# EasyEDA schematic RC_Controller.json
TITLE: Sheet_1; REV: 1.0; Date: 2023-11-12; Sheet: 1/1; Company: Your Company
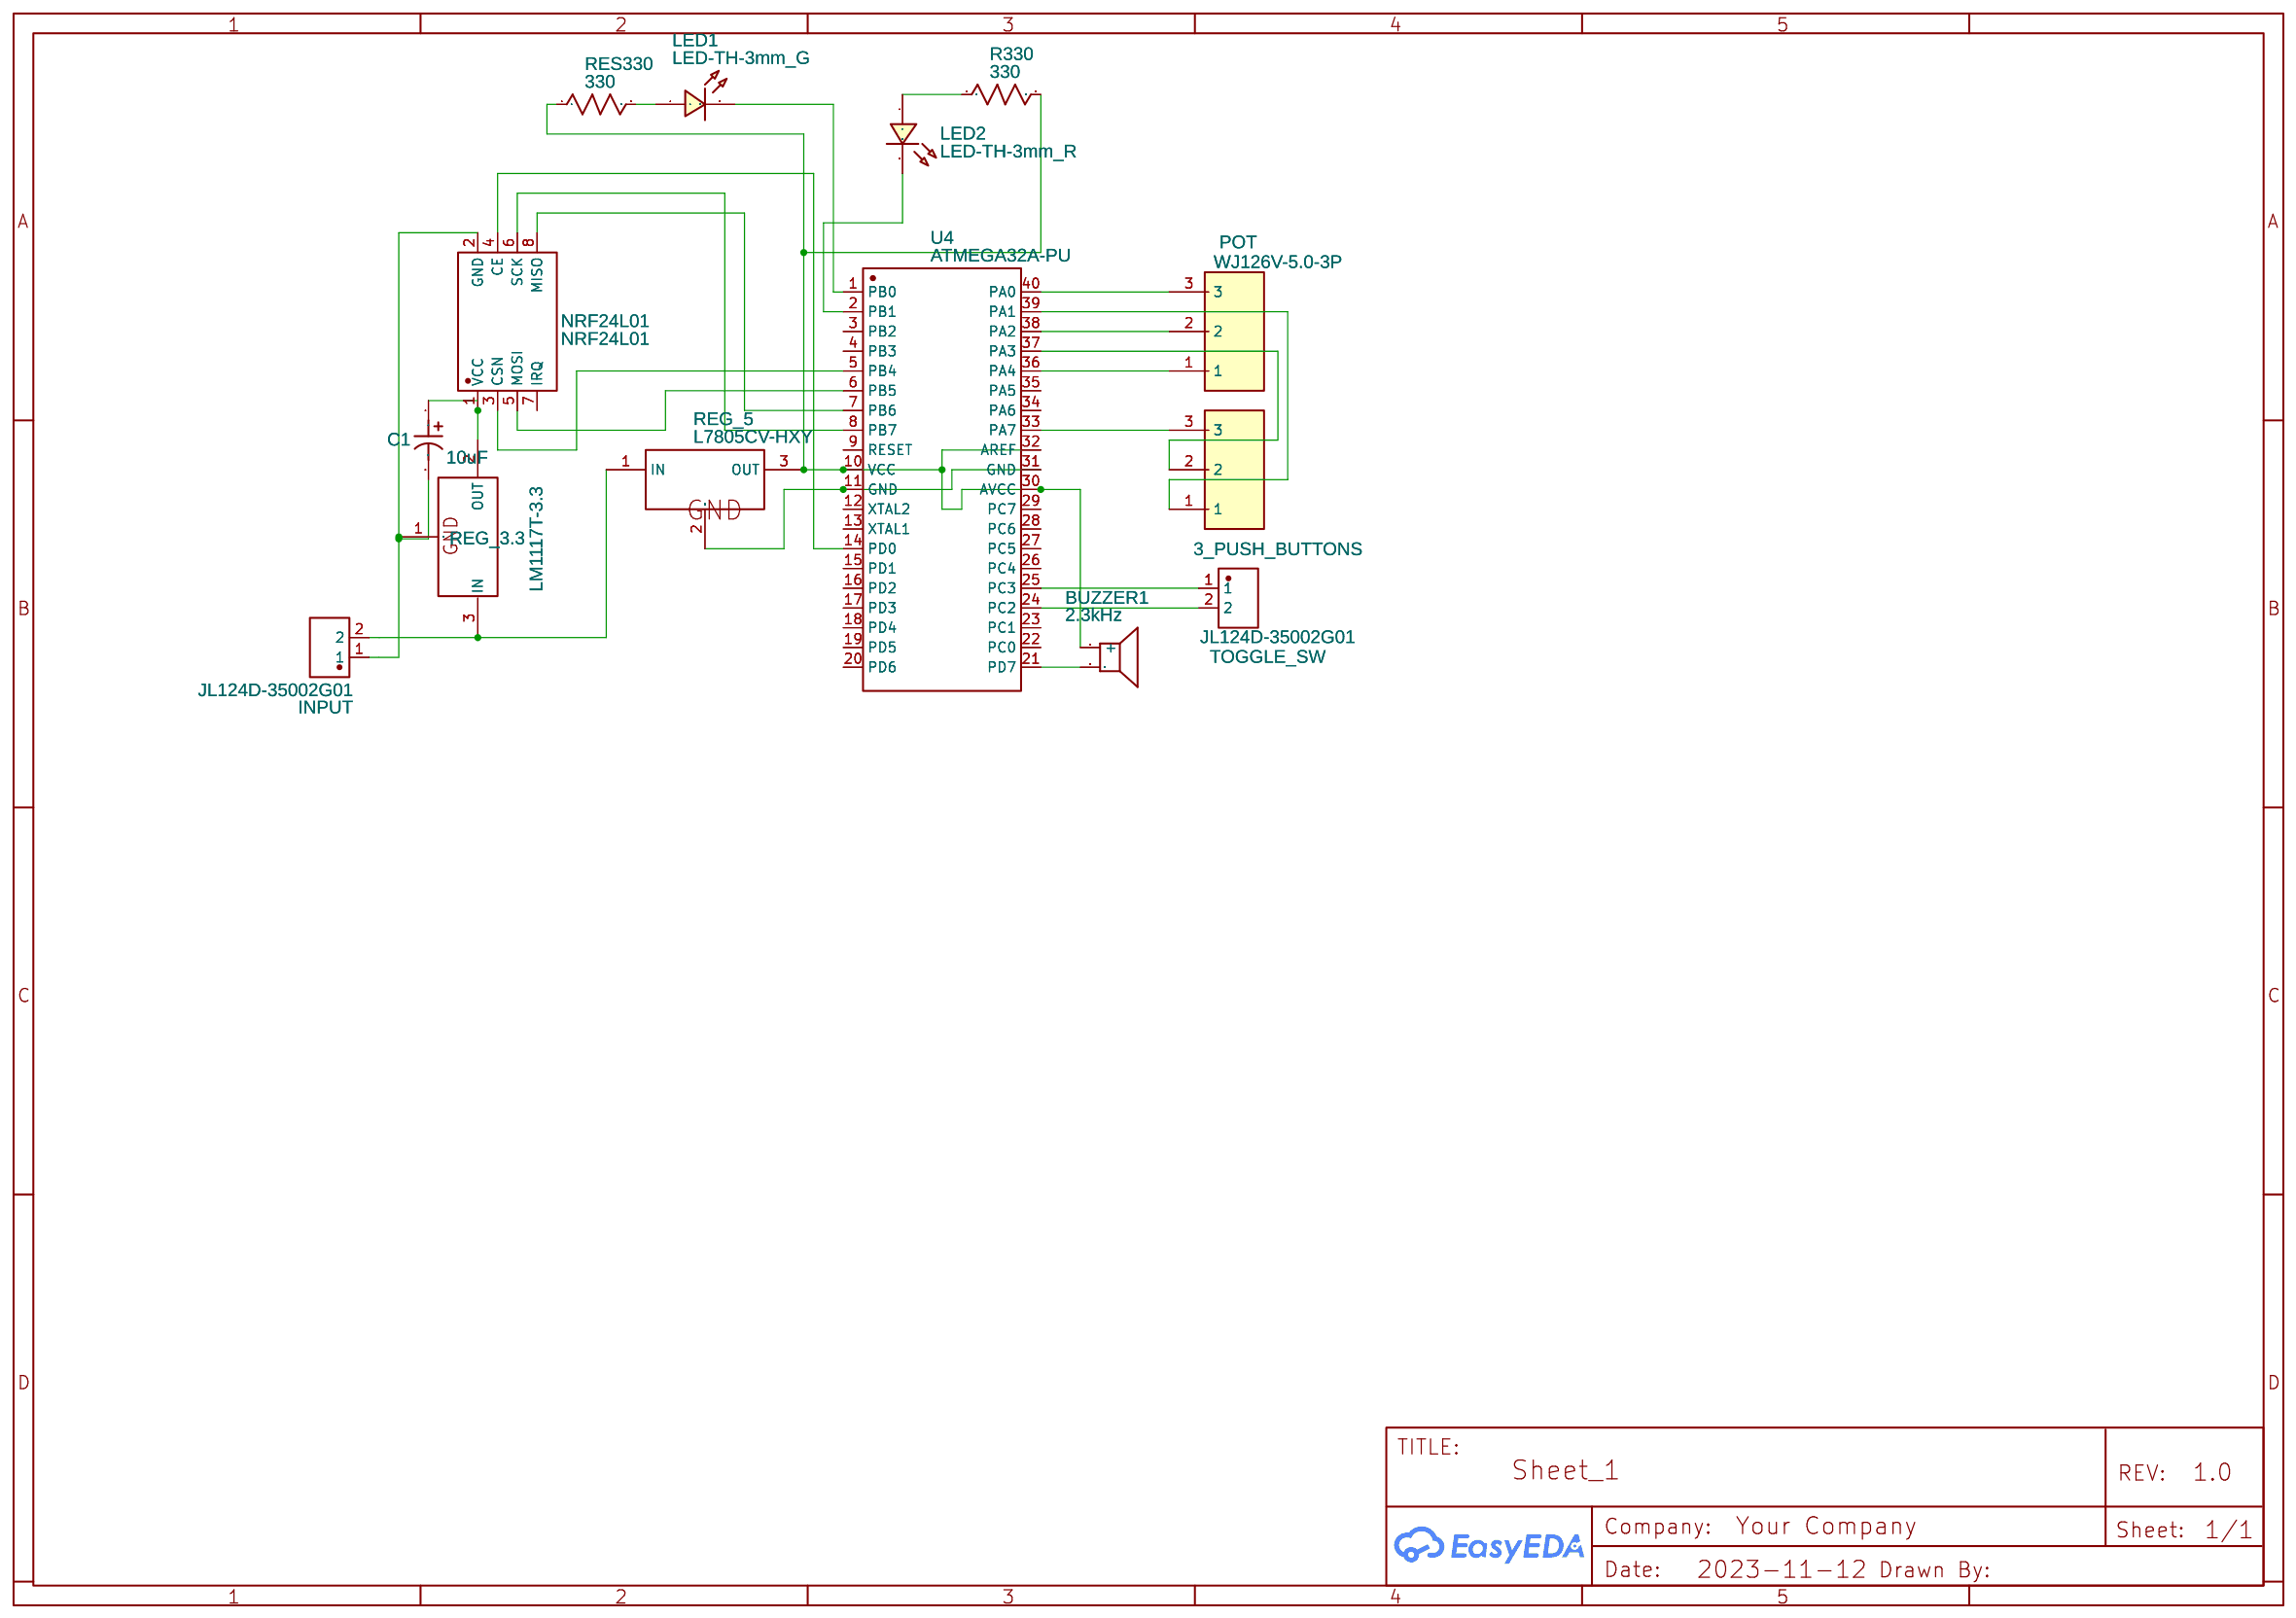
[diagram p0: schematic sheet]

## Parts
3_PUSH_BUTTONS  3_PUSH_BUTTONS  [CONN-TH_3P-P5.00_WJ126V-5.0-3P]
BUZZER1  2.3kHz  [BUZ-TH_BD12.0-P7.60-D0.6-FD]
C1  10uF  [CAP-TH_BD5.0-P2.00-D0.5-FD-1]
INPUT  JL124D-35002G01  [CONN-TH_2P-P3.50_JL124D-35002G01]
LED1  LED-TH-3mm_G  [LED-TH_BD3.0_GREEN]
LED2  LED-TH-3mm_R  [LED-TH_BD3.0_RED]
NRF24L01  NRF24L01  [WIRELM-SMD_NRF24L01]
POT  WJ126V-5.0-3P  [CONN-TH_3P-P5.00_WJ126V-5.0-3P]
R330  330  [R_AXIAL-0.3]
REG_3  LM1117T-3.3  [TO-220-3_L10.0-W4.5-P2.54-L]  (section 3)
REG_5  L7805CV-HXY  [TO-220-3_L10.0-W4.5-P2.54-L]
RES330  330  [R_AXIAL-0.3]
TOGGLE_SW  JL124D-35002G01  [CONN-TH_2P-P3.50_JL124D-35002G01]
U4  ATMEGA32A-PU  [DIP-40_L52.3-W13.9-P2.54-LS15.2-BL]

## Library data of the parts
3_PUSH_BUTTONS POT = WJ126V-5.0-3P: Supplier: LCSC; Manufacturer: KANGNEX(康奈克斯电气); Supplier Part: C8401; JLCPCB Part Class: Extended Part; link: https://lcsc.com/eda_search?q=C8401&%26type=1&ref=editor
BUZZER1 = TMB12A05: Supplier: LCSC; Manufacturer: 华能; Supplier Part: C96093; JLCPCB Part Class: Extended Part; link: https://lcsc.com/eda_search?q=C96093&%26type=1&ref=editor
C1 = EGH1HM100D11OT: Contributor: lcsc; Supplier: LCSC; Supplier Part: C724632; Manufacturer: AISHI(艾华集团); JLCPCB Part Class: Extended Part; link: https://lcsc.com/eda_search?q=C724632&%26type=1&ref=editor
INPUT TOGGLE_SW = JL124D-35002G01: Contributor: LCSC; Supplier: LCSC; Supplier Part: C415432; Manufacturer: JILN(锦凌); JLCPCB Part Class: Extended Part; link: https://lcsc.com/eda_search?q=C415432&%26type=1&ref=editor
LED1 = LED-TH-3mm_G: Manufacturer: EVERLIGHT(台湾亿光); Manufacturer Part: 204-10SYGD/S530-E3; Supplier Part: C85161; Contributor: LCEDA_Lib
LED2 = LED-TH-3mm_R: Manufacturer: EVERLIGHT(台湾亿光); Manufacturer Part: 204-10SDRD/S530-A3-L; Supplier Part: C84774; Supplier: LCSC; Contributor: LCEDA_Lib
NRF24L01 = NRF24L01: Supplier: LCSC; Manufacturer: Ai-Thinker(安信可); Manufacturer Part: NF-04; Supplier Part: C90751; JLCPCB Part Class: Extended Part; link: https://lcsc.com/eda_search?q=C90751&%26type=1&ref=editor
R330 RES330 = R_AXIAL-0.3_US: Contributor: LCEDA_Lib
REG_3 = LM1117T-3.3: Contributor: LCSC; Supplier: LCSC; Supplier Part: C498321; Manufacturer: HGSEMI; JLCPCB Part Class: Extended Part; link: https://lcsc.com/eda_search?q=C498321&%26type=1&ref=editor
REG_5 = L7805CV-HXY: Contributor: lcsc; Supplier: LCSC; Supplier Part: C7469132; Manufacturer: HXY MOSFET(华轩阳电子); link: https://lcsc.com/eda_search?q=C7469132&%26type=1&ref=editor
U4 = ATMEGA32A-PU: Supplier: LCSC; Manufacturer: MICROCHIP(美国微芯); Supplier Part: C12703; JLCPCB Part Class: Extended Part; link: https://lcsc.com/eda_search?q=C12703&%26type=1&ref=editor

## Nets
Net-(3_PUSH_BUTTONS-1): 3_PUSH_BUTTONS.1 U4.39(PA1)
Net-(3_PUSH_BUTTONS-2): 3_PUSH_BUTTONS.2 U4.37(PA3)
Net-(3_PUSH_BUTTONS-3): 3_PUSH_BUTTONS.3 U4.33(PA7)
Net-(BUZZER1-1): BUZZER1.1(+) R330.2 REG_5.3(OUT) RES330.1 U4.10(VCC) U4.30(AVCC) U4.32(AREF)
Net-(BUZZER1-2): BUZZER1.2 U4.21(PD7)
Net-(C1-1): C1.1 NRF24L01.1(VCC) REG_3.2(OUT)
Net-(C1-2): C1.2 INPUT.1 NRF24L01.2(GND) REG_3.1(GND)
Net-(INPUT-2): INPUT.2 REG_3.3(IN) REG_5.1(IN)
Net-(LED1-1): LED1.1 RES330.2
Net-(LED1-2): LED1.2 U4.1(PB0)
Net-(LED2-1): LED2.1 R330.1
Net-(LED2-2): LED2.2 U4.2(PB1)
Net-(NRF24L01-3): NRF24L01.3(CSN) U4.5(PB4)
Net-(NRF24L01-4): NRF24L01.4(CE) U4.14(PD0)
Net-(NRF24L01-5): NRF24L01.5(MOSI) U4.6(PB5)
Net-(NRF24L01-6): NRF24L01.6(SCK) U4.8(PB7)
Net-(NRF24L01-8): NRF24L01.8(MISO) U4.7(PB6)
Net-(POT-1): POT.1 U4.36(PA4)
Net-(POT-2): POT.2 U4.38(PA2)
Net-(POT-3): POT.3 U4.40(PA0)
Net-(REG_5-2): REG_5.2(GND) U4.11(GND) U4.31(GND)
Net-(TOGGLE_SW-1): TOGGLE_SW.1 U4.25(PC3)
Net-(TOGGLE_SW-2): TOGGLE_SW.2 U4.24(PC2)

Not connected (* = marked no-connect by the designer): NRF24L01 7(IRQ); U4 3(PB2) 4(PB3) 9(RESET) 12(XTAL2) 13(XTAL1) 15(PD1) 16(PD2) 17(PD3) 18(PD4) 19(PD5) 20(PD6) 22(PC0) 23(PC1) 26(PC4) 27(PC5) 28(PC6) 29(PC7) 34(PA6) 35(PA5)
